# Altium project remote.PrjPcb
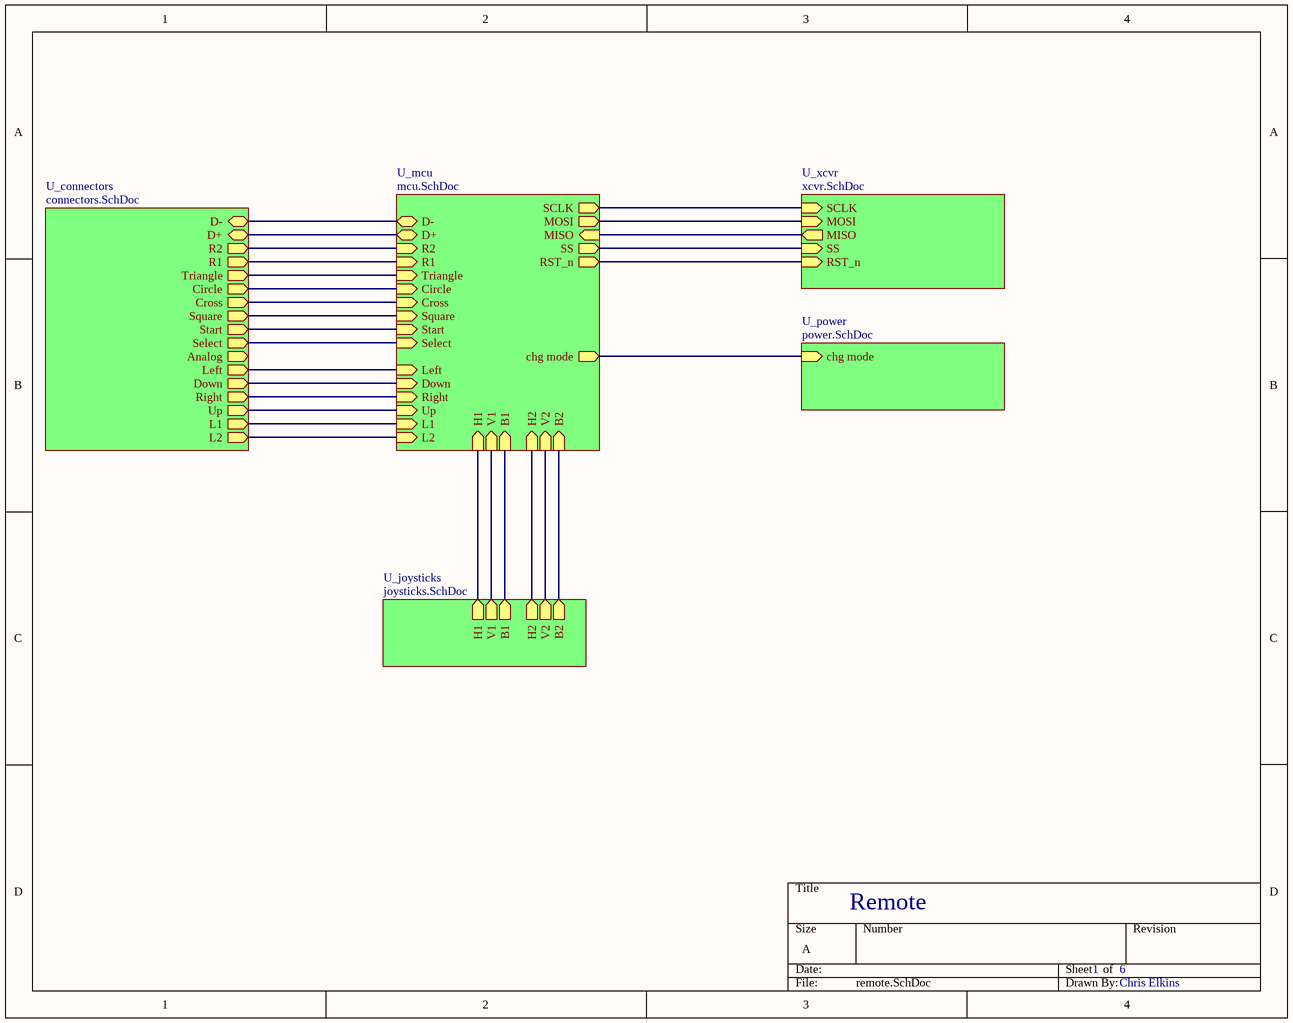
[diagram p0: remote.SchDoc]
4 sheets, 25 parts. Net scope: hierarchical (ports join the sheet entries above them; power ports are global).
Board file: remote.PcbDoc
Sheets:
  remote.SchDoc
    U_connectors = connectors.SchDoc
    U_mcu = mcu.SchDoc
    U_xcvr = xcvr.SchDoc

## Sheet remote.SchDoc
size A

### Sub-sheets
U_connectors = connectors.SchDoc: D- (bidir), D+ (bidir), R2, R1, Triangle, Circle, Cross, Square, Start, Select, Analog, Left, Down, Right, Up, L1, L2
U_joysticks = joysticks.SchDoc (file not in this document): H1 (out), V1 (out), B1 (out), H2 (out), V2 (out), B2 (out)
U_mcu = mcu.SchDoc: SCLK (out), MOSI (out), MISO (in), SS (out), D- (bidir), D+ (bidir), chg mode (out), R2 (in), R1 (in), Triangle (in), Circle (in), Cross (in), Square (in), Start (in), Select (in), RST_n (out), Left (in), Down (in), Right (in), Up (in), L1 (in), L2 (in), H1 (in), V1 (in), B1 (in), H2 (in), V2 (in), B2 (in)
U_power = power.SchDoc (file not in this document): chg mode (in)
U_xcvr = xcvr.SchDoc: SCLK (in), MOSI (in), MISO (out), SS (in), RST_n (in)

### Nets
NetD2_2: sheet U_mcu/chg mode, sheet U_power/chg mode
NetJ1_2: sheet U_connectors/D+, sheet U_mcu/D+
NetJ1_3: sheet U_connectors/D-, sheet U_mcu/D-
NetJ2_1: sheet U_connectors/R2, sheet U_mcu/R2
NetJ2_2: sheet U_connectors/R1, sheet U_mcu/R1
NetJ2_3: sheet U_connectors/Triangle, sheet U_mcu/Triangle
NetJ2_4: sheet U_connectors/Circle, sheet U_mcu/Circle
NetJ2_5: sheet U_connectors/Cross, sheet U_mcu/Cross
NetJ2_6: sheet U_connectors/Square, sheet U_mcu/Square
NetJ2_7: sheet U_connectors/Start, sheet U_mcu/Start
NetJ2_8: sheet U_connectors/Select, sheet U_mcu/Select
NetJ2_11: sheet U_connectors/Left, sheet U_mcu/Left
NetJ2_12: sheet U_connectors/Down, sheet U_mcu/Down
NetJ2_13: sheet U_connectors/Right, sheet U_mcu/Right
NetJ2_14: sheet U_connectors/Up, sheet U_mcu/Up
NetJ2_15: sheet U_connectors/L1, sheet U_mcu/L1
NetJ2_16: sheet U_connectors/L2, sheet U_mcu/L2
NetMCU_8: sheet U_mcu/SS, sheet U_xcvr/SS
NetMCU_9: sheet U_mcu/SCLK, sheet U_xcvr/SCLK
NetMCU_10: sheet U_mcu/MOSI, sheet U_xcvr/MOSI
NetMCU_11: sheet U_mcu/MISO, sheet U_xcvr/MISO
NetMCU_12: sheet U_mcu/B2, sheet U_joysticks/B2
NetMCU_18: sheet U_mcu/B1, sheet U_joysticks/B1
NetMCU_27: sheet U_mcu/RST_n, sheet U_xcvr/RST_n
NetMCU_38: sheet U_mcu/V1, sheet U_joysticks/V1
NetMCU_39: sheet U_mcu/H1, sheet U_joysticks/H1
NetMCU_40: sheet U_mcu/V2, sheet U_joysticks/V2
NetMCU_41: sheet U_mcu/H2, sheet U_joysticks/H2

### Notes on the sheet
- Remote
- 1
- 6
- Chris Elkins

## Sheet connectors.SchDoc
size A
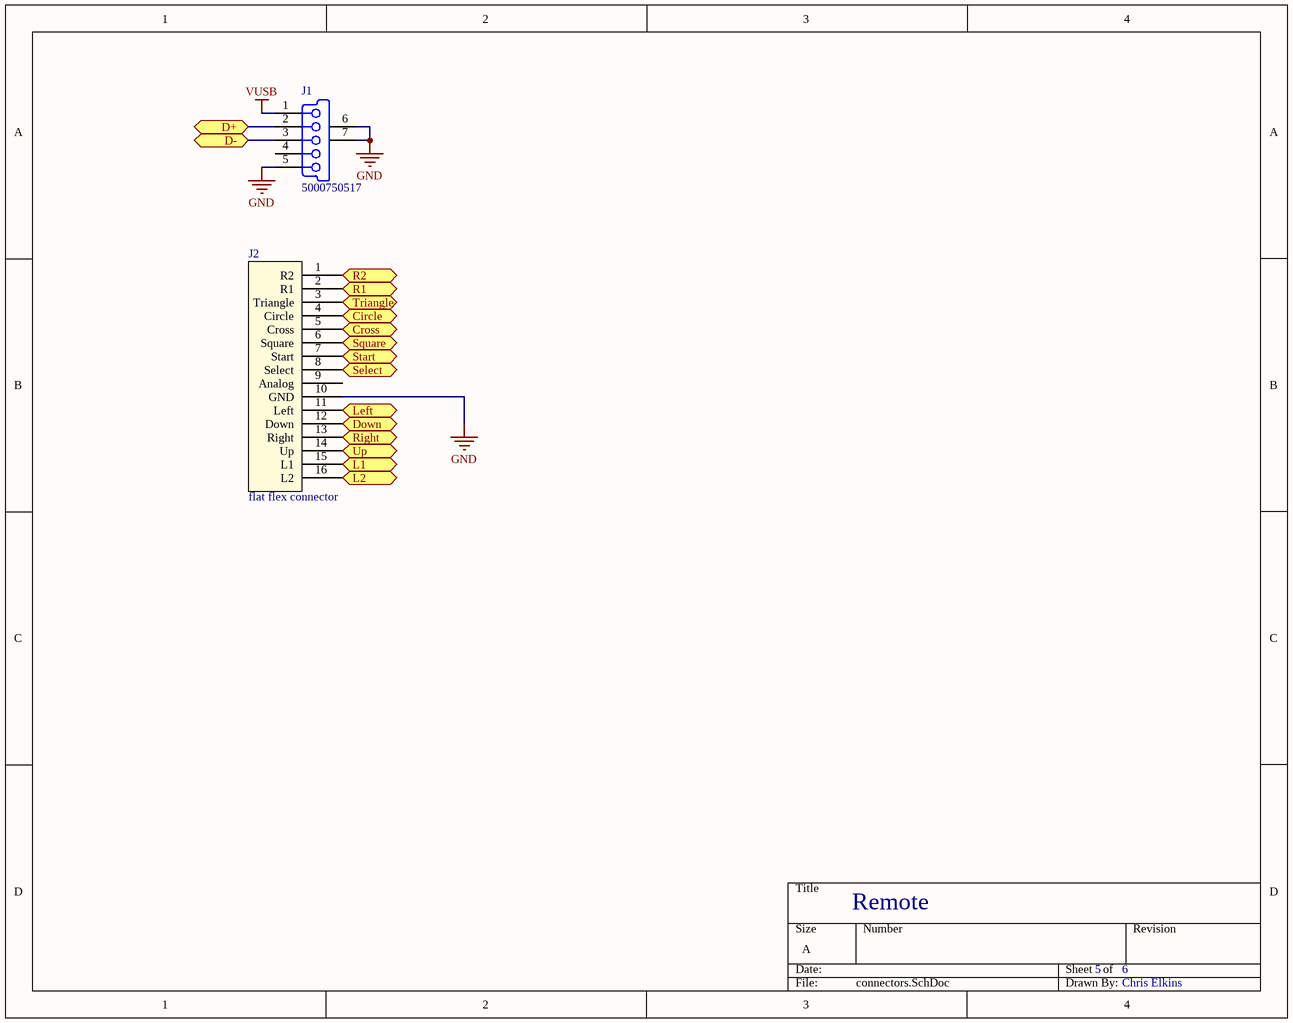
[diagram p1: connectors.SchDoc]

### Parts
J1  5000750517  [5000750517]
J2  flat flex connector  [flex con]

### Ports
Circle, Cross, D+ (bidir), D- (bidir), Down, L1, L2, Left, R1, R2, Right, Select, Square, Start, Triangle, Up

### Nets
GND: J1.5(GND) J1.6(MH1) J1.7(MH2) J2.10(GND)
VUSB: J1.1(V_BUS)
NetJ1_2: J1.2(D-) ; port D+
NetJ1_3: J1.3(D+) ; port D-
NetJ2_1: J2.1(R2) ; port R2
NetJ2_2: J2.2(R1) ; port R1
NetJ2_3: J2.3(Triangle) ; port Triangle
NetJ2_4: J2.4(Circle) ; port Circle
NetJ2_5: J2.5(Cross) ; port Cross
NetJ2_6: J2.6(Square) ; port Square
NetJ2_7: J2.7(Start) ; port Start
NetJ2_8: J2.8(Select) ; port Select
NetJ2_11: J2.11(Left) ; port Left
NetJ2_12: J2.12(Down) ; port Down
NetJ2_13: J2.13(Right) ; port Right
NetJ2_14: J2.14(Up) ; port Up
NetJ2_15: J2.15(L1) ; port L1
NetJ2_16: J2.16(L2) ; port L2

Not connected (* = marked no-connect by the designer): J1 4(ID); J2 9(Analog)

### Notes on the sheet
- Remote
- 5
- 6
- Chris Elkins

### Library data of the parts
J1 = 5000750517: USB On-The-Go (OTG) Mini-B Receptacle, Right Angle, Thru-Hole, 0.80mm (.031") Pitch, Solder Tails & Shell Tabs with Dimples; PCB_Layout: Complies with Manufacturer's Recommendation.; Published: 30-May-2008; DatasheetVersion: rev0, Mar-2004; PackageVersion: rev0, Mar-2004; PackageReference: 5000750517; Publisher: Altium Limited; PackageDescription: USB Mini-B, Type 2, Thru-Hole; 5 Position; Vertical, Body 7.7 x 4.2 x 7.7 mm (LxWxH); ComponentLink1Description: Manufacturer Link; ComponentLink1URL: http://www.molex.com/; ComponentLink2Description: Datasheet; ComponentLink2URL: http://www.molex.com/pdm_docs/sd/5000750517_sd.pdf

## Sheet mcu.SchDoc
size A
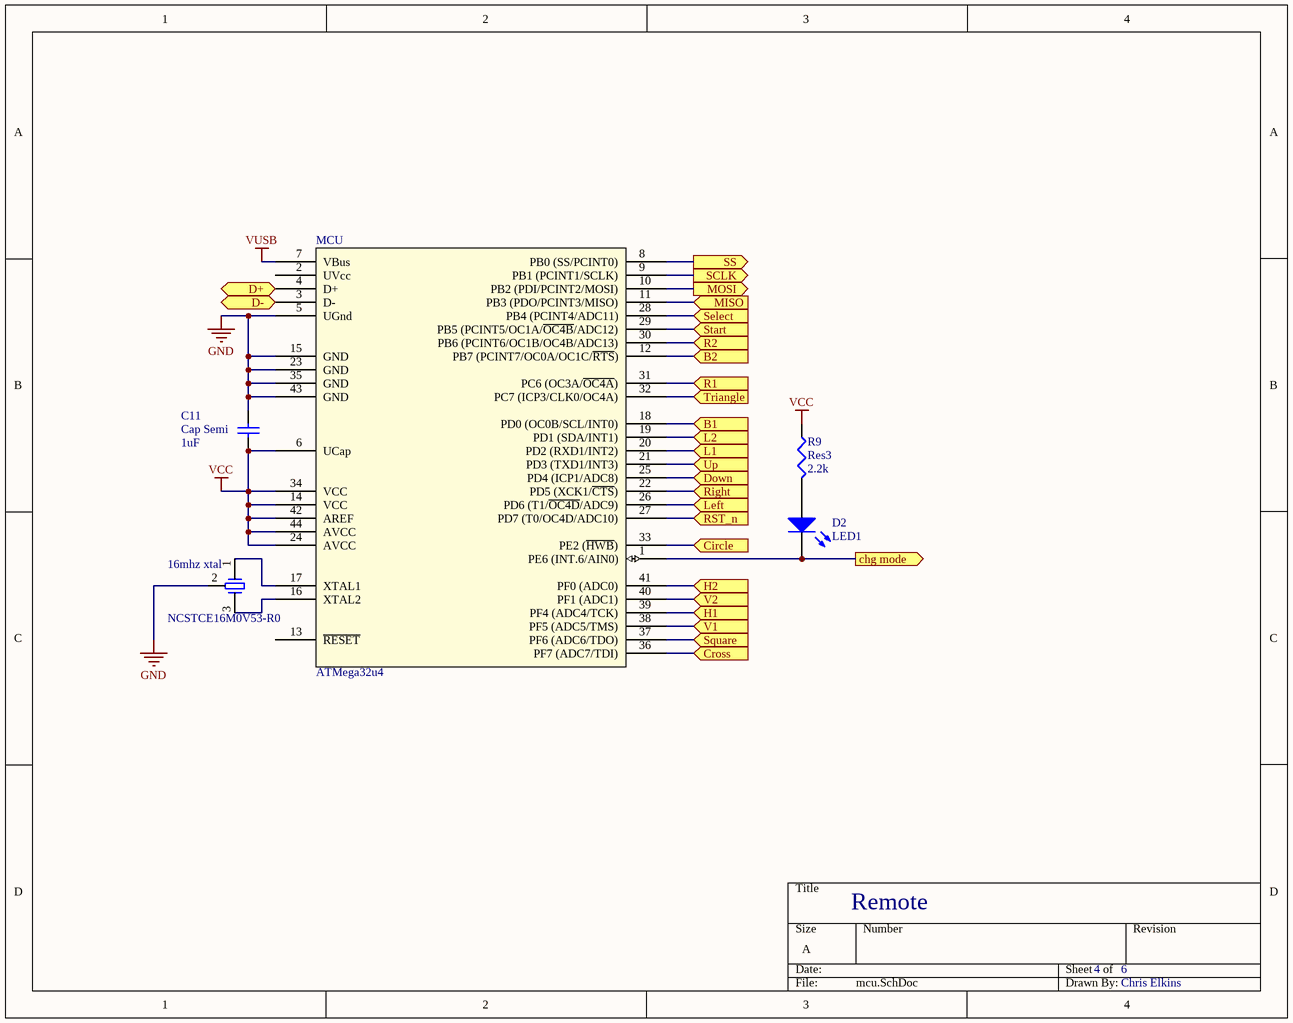
[diagram p2: mcu.SchDoc]

### Parts
16mhz_xtal  NCSTCE16M0V53-R0  [OSC]
C11  Cap Semi  value 1uF  [CAPC1608L]
D2  LED1  [LED-1]
MCU  ATMega32u4  [TQFP44_M]
R9  Res3  value 2.2k  [RESC1608L]

### Ports
B1 (in), B2 (in), chg mode (out), Circle (in), Cross (in), D+ (bidir), D- (bidir), Down (in), H1 (in), H2 (in), L1 (in), L2 (in), Left (in), MISO (in), MOSI (out), R1 (in), R2 (in), Right (in), RST_n (in), SCLK (out), Select (in), Square (in), SS (out), Start (in), Triangle (in), Up (in), V1 (in), V2 (in)

### Nets
GND: 16mhz_xtal.2 C11.2 MCU.5(UGnd) MCU.15(GND) MCU.23(GND) MCU.35(GND) MCU.43(GND)
VCC: C11.1 MCU.6(UCap) MCU.14(VCC) MCU.24(AVCC) MCU.34(VCC) MCU.42(AREF) MCU.44(AVCC) R9.1
VUSB: MCU.7(VBus)
Net16mhz_xtal_1: 16mhz_xtal.1 MCU.17(XTAL1)
Net16mhz_xtal_3: 16mhz_xtal.3 MCU.16(XTAL2)
NetD2_1: D2.1(A) R9.2
NetD2_2: D2.2(K) MCU.1(PE6_(INT.6/AIN0)) ; port chg mode
NetJ1_2: MCU.4(D+) ; port D+
NetJ1_3: MCU.3(D-) ; port D-
NetJ2_1: MCU.30(PB6_(PCINT6/OC1B/OC4B/ADC13)) ; port R2
NetJ2_2: MCU.31(PC6_(OC3A/~{OC4A})) ; port R1
NetJ2_3: MCU.32(PC7_(ICP3/CLK0/OC4A)) ; port Triangle
NetJ2_4: MCU.33(PE2_(~{HWB})) ; port Circle
NetJ2_5: MCU.36(PF7_(ADC7/TDI)) ; port Cross
NetJ2_6: MCU.37(PF6_(ADC6/TDO)) ; port Square
NetJ2_7: MCU.29(PB5_(PCINT5/OC1A/~{OC4B}/ADC12)) ; port Start
NetJ2_8: MCU.28(PB4_(PCINT4/ADC11)) ; port Select
NetJ2_11: MCU.26(PD6_(T1/~{OC4D}/ADC9)) ; port Left
NetJ2_12: MCU.25(PD4_(ICP1/ADC8)) ; port Down
NetJ2_13: MCU.22(PD5_(XCK1/~{CTS})) ; port Right
NetJ2_14: MCU.21(PD3_(TXD1/INT3)) ; port Up
NetJ2_15: MCU.20(PD2_(RXD1/INT2)) ; port L1
NetJ2_16: MCU.19(PD1_(SDA/INT1)) ; port L2
NetMCU_8: MCU.8(PB0_(SS/PCINT0)) ; port SS
NetMCU_9: MCU.9(PB1_(PCINT1/SCLK)) ; port SCLK
NetMCU_10: MCU.10(PB2_(PDI/PCINT2/MOSI)) ; port MOSI
NetMCU_11: MCU.11(PB3_(PDO/PCINT3/MISO)) ; port MISO
NetMCU_12: MCU.12(PB7_(PCINT7/OC0A/OC1C/~{RTS})) ; port B2
NetMCU_18: MCU.18(PD0_(OC0B/SCL/INT0)) ; port B1
NetMCU_27: MCU.27(PD7_(T0/OC4D/ADC10)) ; port RST_n
NetMCU_38: MCU.38(PF5_(ADC5/TMS)) ; port V1
NetMCU_39: MCU.39(PF4_(ADC4/TCK)) ; port H1
NetMCU_40: MCU.40(PF1_(ADC1)) ; port V2
NetMCU_41: MCU.41(PF0_(ADC0)) ; port H2

Not connected (* = marked no-connect by the designer): MCU 2(UVcc) 13(~{RESET})

### Notes on the sheet
- Remote
- 4
- 6
- Chris Elkins

### Library data of the parts
C11 = Cap Semi: Capacitor (Semiconductor SIM Model); Published: 8-Jun-2000; LatestRevisionDate: 29-May-2009; LatestRevisionNote: IPC-7351 Footprint Added.; PackageReference: C1206; Publisher: Altium Limited; PackageDescription: Chip Capacitor
D2 = LED1: Typical RED GaAs LED; Published: 8-Jun-2000; LatestRevisionDate: 08-Jul-2005; LatestRevisionNote: Mech Layer 1 removed.; PackageReference: LED-1; Publisher: Altium Limited
MCU = ATMega32u4: usb enabled avr microcontroller
R9 = Res3: Resistor; Published: 8-Jun-2000; LatestRevisionDate: 29-May-2009; LatestRevisionNote: IPC-7351 Footprint Added.; PackageReference: J1-0603; Publisher: Altium Limited; PackageDescription: Chip Resistor

## Sheet xcvr.SchDoc
size A
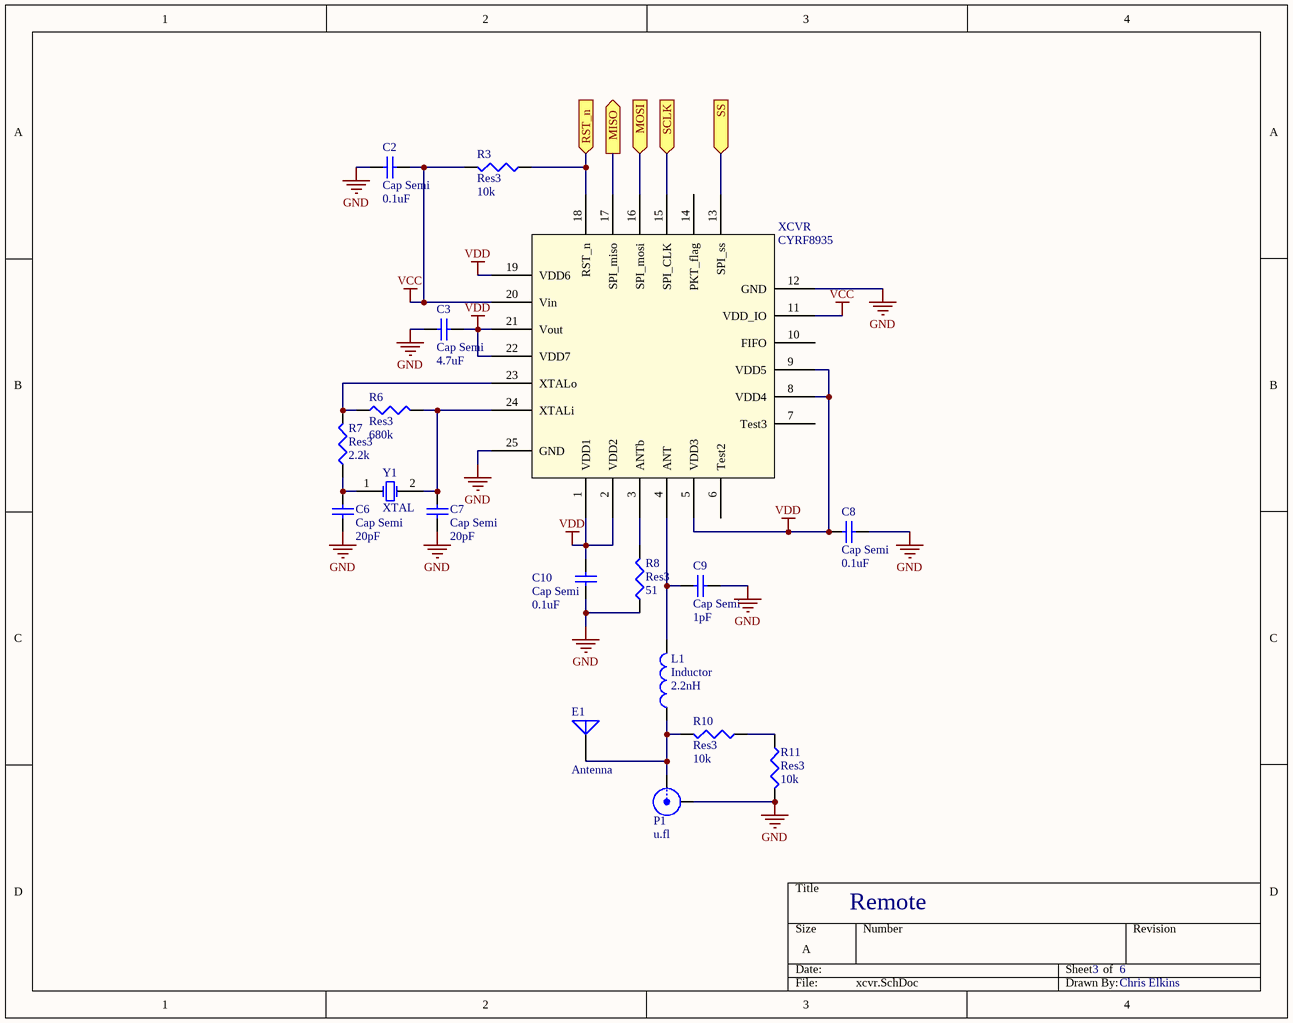
[diagram p3: xcvr.SchDoc]

### Parts
C2  Cap Semi  value 0.1uF  [CAPC1608L]
C3  Cap Semi  value 4.7uF  [CAPC1608L]
C6  Cap Semi  value 20pF  [CAPC1608L]
C7  Cap Semi  value 20pF  [CAPC1608L]
C8  Cap Semi  value 0.1uF  [CAPC1608L]
C9  Cap Semi  value 1pF  [CAPC1608L]
C10  Cap Semi  value 0.1uF  [CAPC1608L]
E1  Antenna  [PIN1]
L1  Inductor  value 2.2nH  [INDC1608L]
P1  u.fl  [U.FL connector]
R3  Res3  value 10k  [RESC1608L]
R6  Res3  value 680k  [RESC1608L]
R7  Res3  value 2.2k  [RESC1608L]
R8  Res3  value 51  [RESC1608L]
R10  Res3  value 10k  [RESC1608L]
R11  Res3  value 10k  [RESC1608L]
XCVR  CYRF8935  [QFN50P400X400-24VAL]
Y1  XTAL  [PCBComponent_1]

### Ports
MISO (out), MOSI (in), RST_n (in), SCLK (in), SS (in)

### Nets
GND: C2.1 C3.1 C6.1 C7.1 C8.1 C9.2 C10.2 P1.2(Y) R8.1 R11.2 XCVR.12(GND) XCVR.25(GND)
VCC: C2.2 R3.2 XCVR.11(VDD_IO) XCVR.20(Vin)
VDD: C3.2 C8.2 C10.1 XCVR.1(VDD1) XCVR.2(VDD2) XCVR.5(VDD3) XCVR.8(VDD4) XCVR.9(VDD5) XCVR.19(VDD6) XCVR.21(Vout) XCVR.22(VDD7)
NetC6_2: C6.2 R7.1 Y1.1(OSC1)
NetC7_2: C7.2 R6.2 XCVR.24(XTALi) Y1.2(OSC2)
NetC9_1: C9.1 L1.2 XCVR.4(ANT)
NetE1_1: E1.1(A) L1.1 P1.1(X) R10.2
NetMCU_8: XCVR.13(SPI_ss) ; port SS
NetMCU_9: XCVR.15(SPI_CLK) ; port SCLK
NetMCU_10: XCVR.16(SPI_mosi) ; port MOSI
NetMCU_11: XCVR.17(SPI_miso) ; port MISO
NetMCU_27: R3.1 XCVR.18(RST_n) ; port RST_n
NetR6_1: R6.1 R7.2 XCVR.23(XTALo)
NetR8_2: R8.2 XCVR.3(ANTb)
NetR10_1: R10.1 R11.1

Not connected (* = marked no-connect by the designer): XCVR 6(Test2) 7(Test3) 10(FIFO) 14(PKT_flag)

### Notes on the sheet
- Remote
- 3
- 6
- Chris Elkins

### Library data of the parts
C2 C3 C6-C10 = Cap Semi: Capacitor (Semiconductor SIM Model); Published: 8-Jun-2000; LatestRevisionDate: 29-May-2009; LatestRevisionNote: IPC-7351 Footprint Added.; PackageReference: C1206; Publisher: Altium Limited; PackageDescription: Chip Capacitor
E1 = Antenna: Generic Antenna; Published: 24-Mar-1999; LatestRevisionDate: 17-Jul-2002; LatestRevisionNote: Re-released for DXP Platform.; PackageReference: PIN1; Publisher: Altium Limited
L1 = Inductor: Code_IEC: 1005; Published: 8-Jun-2000; LatestRevisionDate: 29-May-2009; LatestRevisionNote: IPC-7351 Footprint Added.; PackageReference: 0402-A; Publisher: Altium Limited; PackageDescription: Chip Inductor; Code_JEITA: 0402
P1 = BNC: BNC Elbow Connector; LatestRevisionDate: 17-Jul-2002; LatestRevisionNote: Re-released for DXP Platform.; Publisher: Altium Limited
R3 R6-R8 R10 R11 = Res3: Resistor; Published: 8-Jun-2000; LatestRevisionDate: 29-May-2009; LatestRevisionNote: IPC-7351 Footprint Added.; PackageReference: J1-0603; Publisher: Altium Limited; PackageDescription: Chip Resistor
Y1 = XTAL: Crystal Oscillator; Published: 8-Jun-2000; LatestRevisionDate: 17-Jul-2002; LatestRevisionNote: Re-released for DXP Platform.; PackageReference: R38; Publisher: Altium Limited

## Nets that join several sheets
GND: connectors (J1.5 J1.6 J1.7 J2.10), mcu (7 pins), xcvr (12 pins)
VCC: mcu (8 pins), xcvr (C2.2 R3.2 XCVR.11 XCVR.20)
VUSB: connectors (J1.1), mcu (MCU.7)
NetJ1_2: connectors (J1.2), mcu (MCU.4)
NetJ1_3: connectors (J1.3), mcu (MCU.3)
NetJ2_1: connectors (J2.1), mcu (MCU.30)
NetJ2_2: connectors (J2.2), mcu (MCU.31)
NetJ2_3: connectors (J2.3), mcu (MCU.32)
NetJ2_4: connectors (J2.4), mcu (MCU.33)
NetJ2_5: connectors (J2.5), mcu (MCU.36)
NetJ2_6: connectors (J2.6), mcu (MCU.37)
NetJ2_7: connectors (J2.7), mcu (MCU.29)
NetJ2_8: connectors (J2.8), mcu (MCU.28)
NetJ2_11: connectors (J2.11), mcu (MCU.26)
NetJ2_12: connectors (J2.12), mcu (MCU.25)
NetJ2_13: connectors (J2.13), mcu (MCU.22)
NetJ2_14: connectors (J2.14), mcu (MCU.21)
NetJ2_15: connectors (J2.15), mcu (MCU.20)
NetJ2_16: connectors (J2.16), mcu (MCU.19)
NetMCU_8: mcu (MCU.8), xcvr (XCVR.13)
NetMCU_9: mcu (MCU.9), xcvr (XCVR.15)
NetMCU_10: mcu (MCU.10), xcvr (XCVR.16)
NetMCU_11: mcu (MCU.11), xcvr (XCVR.17)
NetMCU_27: mcu (MCU.27), xcvr (R3.1 XCVR.18)